# Altium schematic sheet Backplane.SchDoc
size C portrait; Author: E. Sims; Organization: Let's Build Rockets Inc.; SheetNumber: 1; SheetTotal: 11
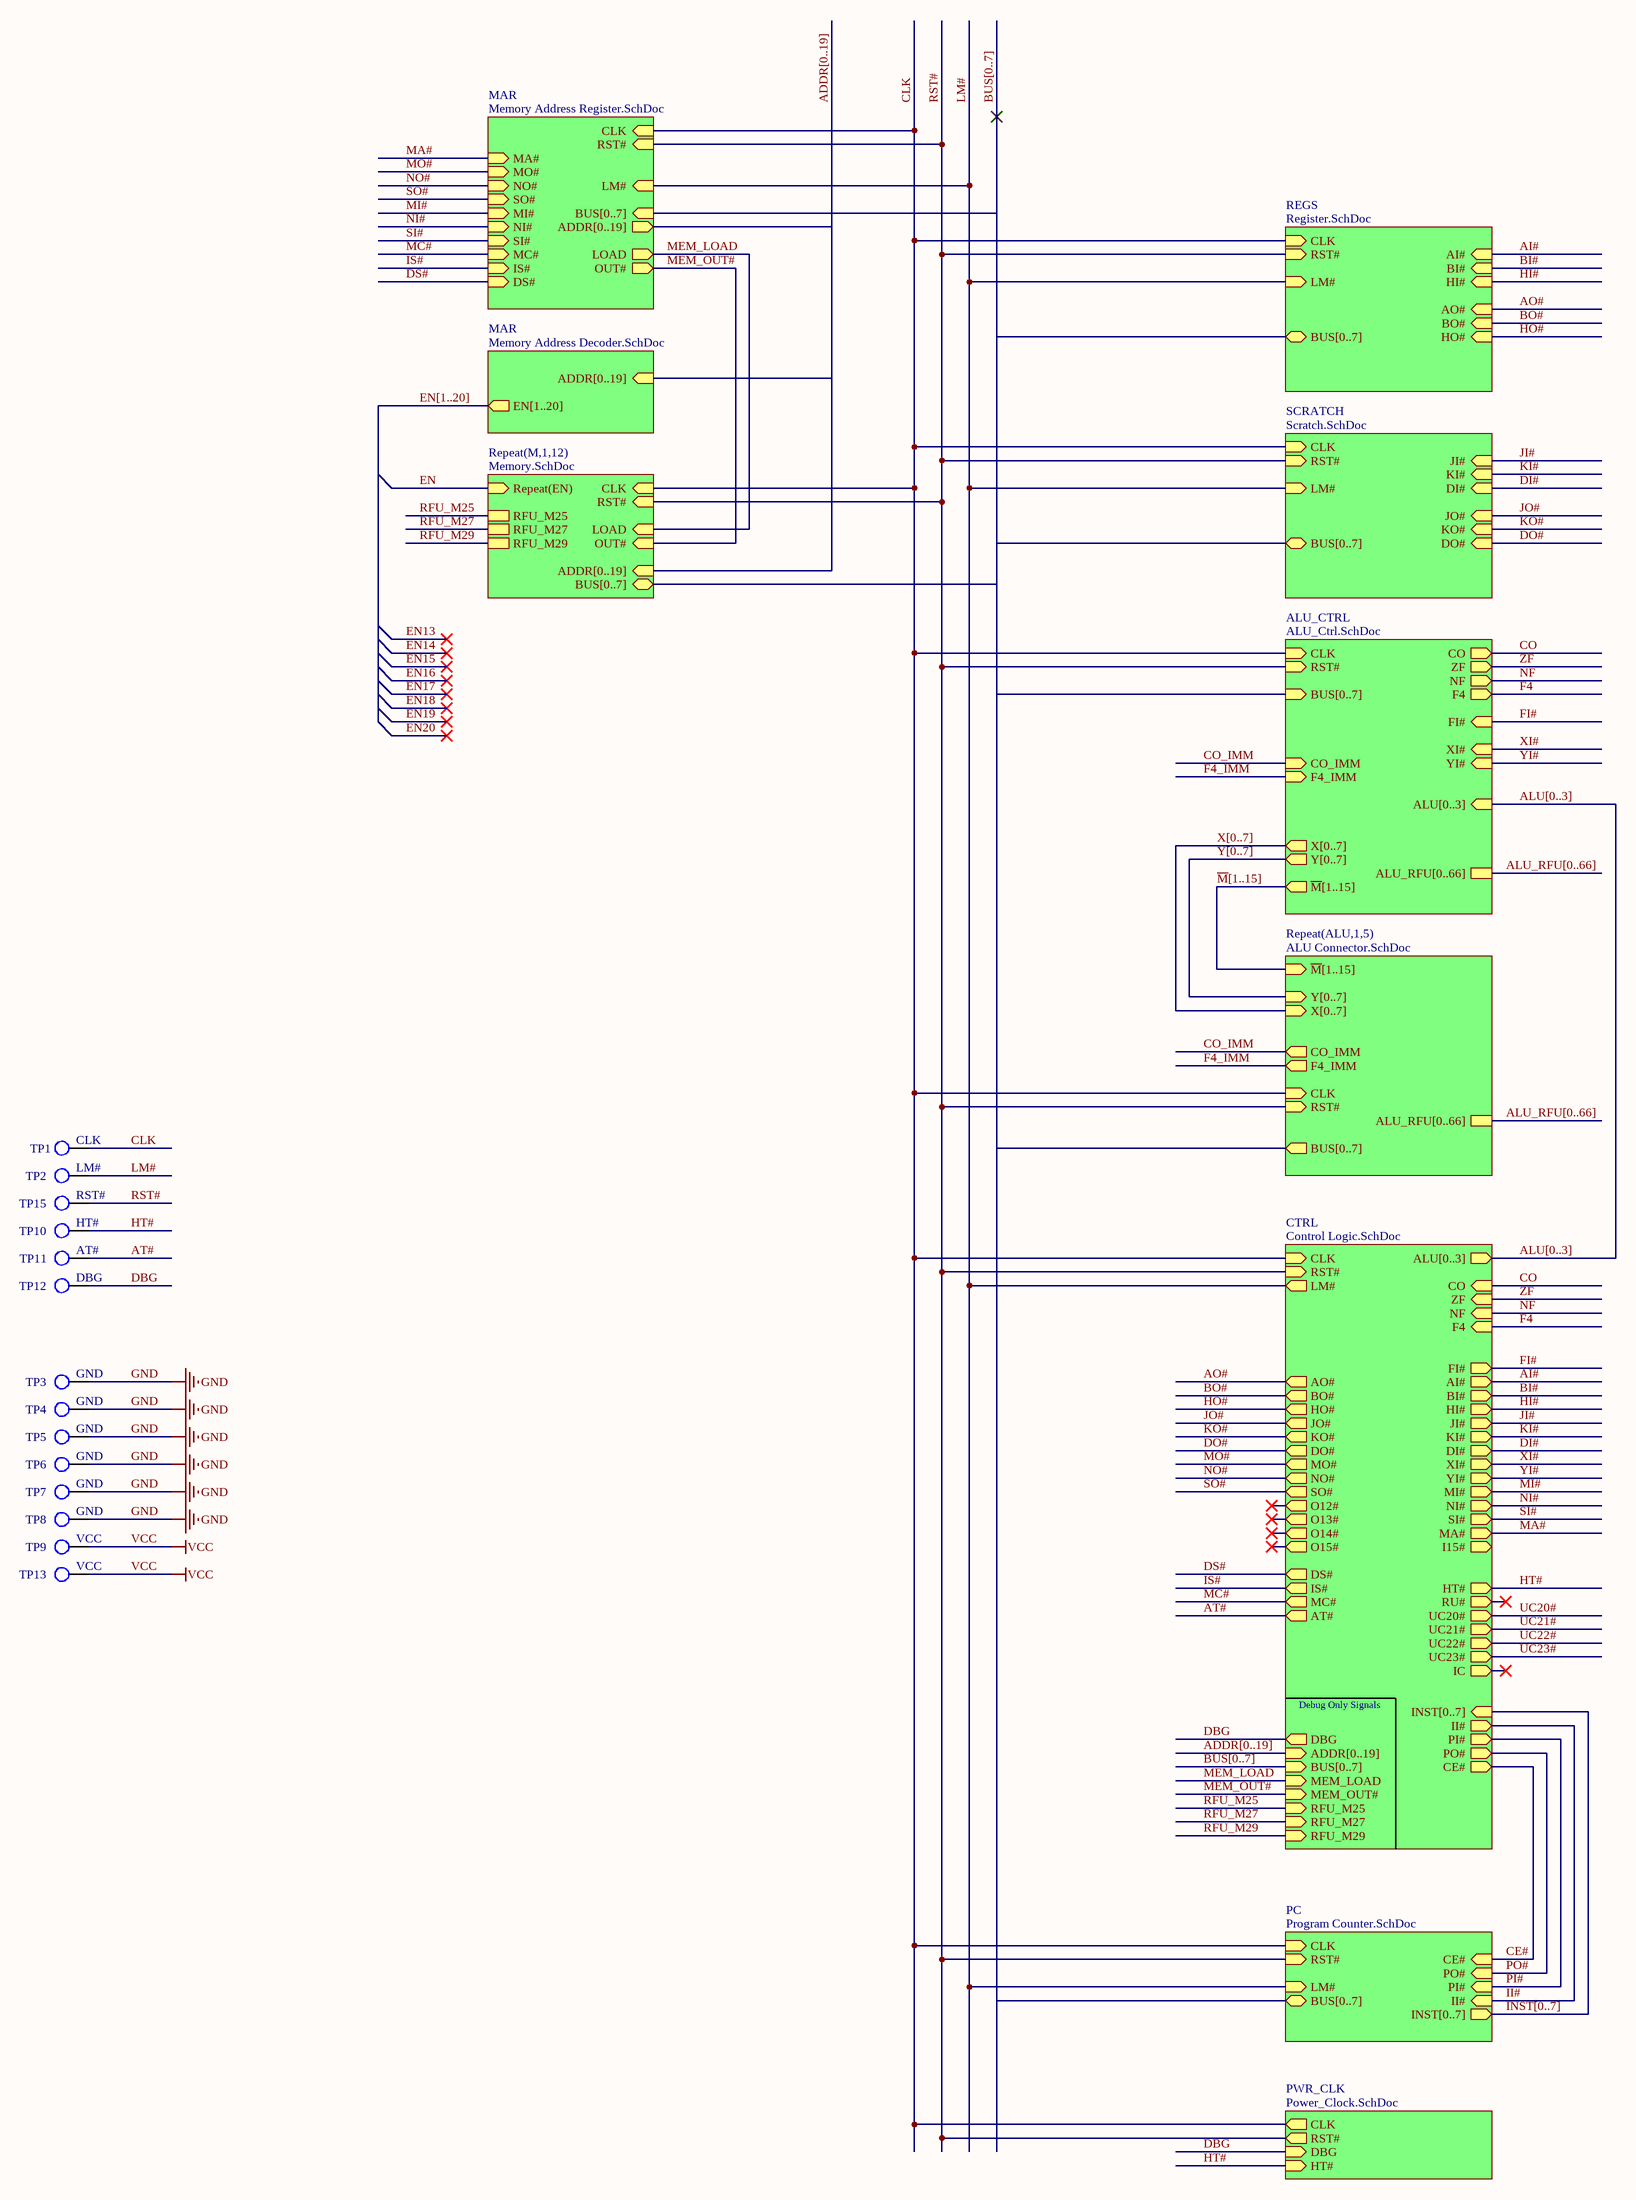
[diagram p0: Backplane.SchDoc]

## Parts
TP1  CLK  [KSTN-5011_V]  (no BOM)
TP2  LM#  [KSTN-5011_V]  (no BOM)
TP3  GND  [KSTN-5011_V]  (no BOM)
TP4  GND  [KSTN-5011_V]  (no BOM)
TP5  GND  [KSTN-5011_V]  (no BOM)
TP6  GND  [KSTN-5011_V]  (no BOM)
TP7  GND  [KSTN-5011_V]  (no BOM)
TP8  GND  [KSTN-5011_V]  (no BOM)
TP9  VCC  [KSTN-5011_V]  (no BOM)
TP10  HT#  [KSTN-5011_V]  (no BOM)
TP11  AT#  [KSTN-5011_V]  (no BOM)
TP12  DBG  [KSTN-5011_V]  (no BOM)
TP13  VCC  [KSTN-5011_V]  (no BOM)
TP15  RST#  [KSTN-5011_V]  (no BOM)

## Sub-sheets
ALU_CTRL = ALU_Ctrl.SchDoc: CLK (in), RST# (in), BUS[0..7] (in), CO (out), ZF (out), NF (out), CO_IMM (in), F4_IMM (in), F4 (out), FI# (in), XI# (in), ALU[0..3] (in), ~{M}[1..15] (out), YI# (in), Y[0..7] (out), X[0..7] (out), ALU_RFU[0..66]
CTRL = Control Logic.SchDoc: CLK (in), RST# (in), AI# (out), BI# (out), PI# (out), MO# (out), FI# (out), AO# (out), MA# (out), CE# (out), CO (in), ZF (in), ALU[0..3] (out), II# (out), PO# (out), INST[0..7] (in), O14# (out), YI# (out), KO# (out), O15# (out), O12# (out), HI# (out), O13# (out), HT# (out), DO# (out), XI# (out), KI# (out), DI# (out), NI# (out), MI# (out), JI# (out), I15# (out), SI# (out), BO# (out), UC22# (out), AT# (out), NO# (out), DS# (out), UC23# (out), SO# (out), JO# (out), LM# (out), IS# (out), MC# (out), HO# (out), IC (out), RU# (out), UC21# (out), UC20# (out), DBG (out), NF (in), F4 (in), ADDR[0..19] (in), BUS[0..7] (in), RFU_M29 (in), RFU_M25 (in), RFU_M27 (in), MEM_LOAD (in), MEM_OUT# (in)
MAR = Memory Address Register.SchDoc: ADDR[0..19] (out), CLK (in), BUS[0..7] (in), RST# (in), LM# (in), MO# (in), NO# (in), SO# (in), NI# (in), MI# (in), SI# (in), LOAD (out), OUT# (out), MA# (in), DS# (in), IS# (in), MC# (in)
MAR = Memory Address Decoder.SchDoc: ADDR[0..19] (in), EN[1..20] (out)
PC = Program Counter.SchDoc: LM# (in), CLK (in), RST# (in), PO# (in), PI# (in), CE# (in), II# (in), INST[0..7] (out), BUS[0..7] (bidir)
PWR_CLK = Power_Clock.SchDoc: CLK (out), RST# (out), DBG (in), HT# (in)
REGS = Register.SchDoc: CLK (in), RST# (in), BUS[0..7] (bidir), AI# (in), LM# (in), HO# (in), AO# (in), HI# (in), BI# (in), BO# (in)
Repeat(ALU,1,5) = ALU Connector.SchDoc: CO_IMM (out), Y[0..7] (in), X[0..7] (in), BUS[0..7] (out), ~{M}[1..15] (in), F4_IMM (out), CLK (in), RST# (in), ALU_RFU[0..66]
Repeat(M,1,12) = Memory.SchDoc: ADDR[0..19] (in), CLK (in), BUS[0..7] (bidir), LOAD (in), RST# (in), OUT# (in), Repeat(EN) (in), RFU_M29, RFU_M25, RFU_M27
SCRATCH = Scratch.SchDoc: CLK (in), RST# (in), BUS[0..7] (bidir), LM# (in), DO# (in), DI# (in), KO# (in), JI# (in), JO# (in), KI# (in)

## Nets
GND: TP3.1 TP4.1 TP5.1 TP6.1 TP7.1 TP8.1
VCC: TP9.1 TP13.1
AI#: sheet REGS/AI#, sheet CTRL/AI#
AO#: sheet REGS/AO#, sheet CTRL/AO#
AT#: TP11.1 ; sheet CTRL/AT#
BI#: sheet REGS/BI#, sheet CTRL/BI#
BO#: sheet REGS/BO#, sheet CTRL/BO#
CE#: sheet PC/CE#, sheet CTRL/CE#
CLK: TP1.1 ; sheet REGS/CLK, sheet MAR/CLK, sheet Repeat(M,1,12)/CLK, sheet PC/CLK, sheet SCRATCH/CLK, sheet CTRL/CLK, sheet ALU_CTRL/CLK, sheet Repeat(ALU,1,5)/CLK, sheet PWR_CLK/CLK
CO: sheet CTRL/CO, sheet ALU_CTRL/CO
CO_IMM: sheet ALU_CTRL/CO_IMM, sheet Repeat(ALU,1,5)/CO_IMM
DBG: TP12.1 ; sheet CTRL/DBG, sheet PWR_CLK/DBG
DI#: sheet SCRATCH/DI#, sheet CTRL/DI#
DO#: sheet SCRATCH/DO#, sheet CTRL/DO#
DS#: sheet MAR/DS#, sheet CTRL/DS#
EN: sheet Repeat(M,1,12)/Repeat(EN)
F4: sheet CTRL/F4, sheet ALU_CTRL/F4
F4_IMM: sheet ALU_CTRL/F4_IMM, sheet Repeat(ALU,1,5)/F4_IMM
FI#: sheet CTRL/FI#, sheet ALU_CTRL/FI#
HI#: sheet REGS/HI#, sheet CTRL/HI#
HO#: sheet REGS/HO#, sheet CTRL/HO#
HT#: TP10.1 ; sheet CTRL/HT#, sheet PWR_CLK/HT#
II#: sheet PC/II#, sheet CTRL/II#
IS#: sheet MAR/IS#, sheet CTRL/IS#
JI#: sheet SCRATCH/JI#, sheet CTRL/JI#
JO#: sheet SCRATCH/JO#, sheet CTRL/JO#
KI#: sheet SCRATCH/KI#, sheet CTRL/KI#
KO#: sheet SCRATCH/KO#, sheet CTRL/KO#
LM#: TP2.1 ; sheet REGS/LM#, sheet MAR/LM#, sheet PC/LM#, sheet SCRATCH/LM#, sheet CTRL/LM#
MA#: sheet MAR/MA#, sheet CTRL/MA#
MC#: sheet MAR/MC#, sheet CTRL/MC#
MEM_LOAD: sheet MAR/LOAD, sheet Repeat(M,1,12)/LOAD, sheet CTRL/MEM_LOAD
MEM_OUT#: sheet MAR/OUT#, sheet Repeat(M,1,12)/OUT#, sheet CTRL/MEM_OUT#
MI#: sheet MAR/MI#, sheet CTRL/MI#
MO#: sheet MAR/MO#, sheet CTRL/MO#
NF: sheet CTRL/NF, sheet ALU_CTRL/NF
NI#: sheet MAR/NI#, sheet CTRL/NI#
NO#: sheet MAR/NO#, sheet CTRL/NO#
PI#: sheet PC/PI#, sheet CTRL/PI#
PO#: sheet PC/PO#, sheet CTRL/PO#
RFU_M25: sheet Repeat(M,1,12)/RFU_M25, sheet CTRL/RFU_M25
RFU_M27: sheet Repeat(M,1,12)/RFU_M27, sheet CTRL/RFU_M27
RFU_M29: sheet Repeat(M,1,12)/RFU_M29, sheet CTRL/RFU_M29
RST#: TP15.1 ; sheet REGS/RST#, sheet MAR/RST#, sheet Repeat(M,1,12)/RST#, sheet PC/RST#, sheet SCRATCH/RST#, sheet CTRL/RST#, sheet ALU_CTRL/RST#, sheet Repeat(ALU,1,5)/RST#, sheet PWR_CLK/RST#
SI#: sheet MAR/SI#, sheet CTRL/SI#
SO#: sheet MAR/SO#, sheet CTRL/SO#
UC20#: sheet CTRL/UC20#
UC21#: sheet CTRL/UC21#
UC22#: sheet CTRL/UC22#
UC23#: sheet CTRL/UC23#
XI#: sheet CTRL/XI#, sheet ALU_CTRL/XI#
YI#: sheet CTRL/YI#, sheet ALU_CTRL/YI#
ZF: sheet CTRL/ZF, sheet ALU_CTRL/ZF

## Buses and harness runs
bus ADDR[0..19] = sheet CTRL/ADDR[0..19]
bus ADDR[0..19] = sheet MAR/ADDR[0..19] = sheet Repeat(M,1,12)/ADDR[0..19]
bus ALU[0..3] = sheet ALU_CTRL/ALU[0..3] = sheet CTRL/ALU[0..3]
bus ALU_RFU[0..66] = sheet ALU_CTRL/ALU_RFU[0..66]
bus ALU_RFU[0..66] = sheet Repeat(ALU,1,5)/ALU_RFU[0..66]
bus BUS[0..7] = sheet ALU_CTRL/BUS[0..7] = sheet MAR/BUS[0..7] = sheet PC/BUS[0..7] = sheet REGS/BUS[0..7] = sheet Repeat(ALU,1,5)/BUS[0..7] = sheet Repeat(M,1,12)/BUS[0..7] = sheet SCRATCH/BUS[0..7]
bus BUS[0..7] = sheet CTRL/BUS[0..7]
bus EN[1..20] = sheet MAR/EN[1..20]
bus INST[0..7] = sheet CTRL/INST[0..7] = sheet PC/INST[0..7]
bus X[0..7] = sheet ALU_CTRL/X[0..7] = sheet Repeat(ALU,1,5)/X[0..7]
bus Y[0..7] = sheet ALU_CTRL/Y[0..7] = sheet Repeat(ALU,1,5)/Y[0..7]
bus ~{M}[1..15] = sheet ALU_CTRL/~{M}[1..15] = sheet Repeat(ALU,1,5)/~{M}[1..15]

## Notes on the sheet
- Debug Only Signals
- Let's Build Rocket's Inc. Modular Paylaod System Based on TMP-010 Rev
  For more information visit https://github.com/LetsBuildRockets/Modular-Payload-System
  This work is licensed under CC BY-NC 4.0. To view a copy of this license, visit https://creativecommons.org/licenses/by-nc/4.0
- Title
- Size:
- Date:
- Assembly Variant:
- B
- Number:
- Time:
- Revision:
- Sheet
- of
- Author:
- File:

## Library data of the parts
TP1-TP13 TP15 = TP